# EAGLE design SmartRock_MS5803_Breakout (EAGLE 9.6.2)
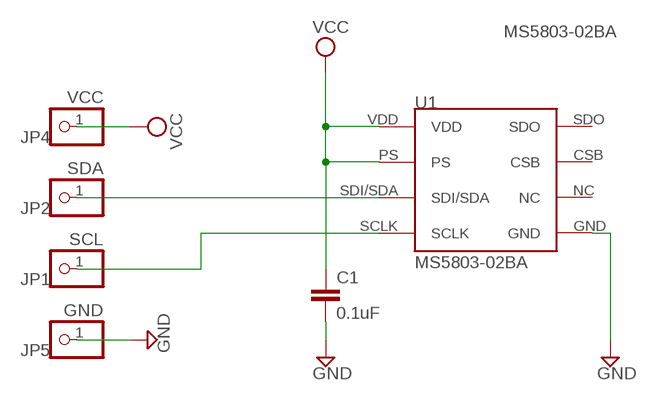
[diagram p0: schematic, sheet 1]

## Parts
C1  0.1uF  C-EUC0805  [C0805]
JP1  SCL  PINHD-1X1  [1X01]
JP2  SDA  PINHD-1X1  [1X01]
JP4  VCC  PINHD-1X1  [1X01]
JP5  GND  PINHD-1X1  [1X01]
U1  MS5803-02BA  [MS5803-02BA]

## Nets
GND: C1.2 JP5.1 U1.GND
N$1: JP2.1 U1.SDI/SDA
N$2: JP1.1 U1.SCLK
VCC: C1.1 JP4.1 U1.PS U1.VDD
Unconnected: U1.CSB U1.NC U1.SDO

## Notes on the sheet
- MS5803-02BA

## Library data of the parts
C1 = rcl:C-EU: CAPACITOR, European symbol; SPICEPREFIX: C
JP1 JP2 JP4 JP5 = pinhead_simple:PINHD-1X1: PIN HEADER
U1 = PNNL_Probe:MS5803-02BA

## Board
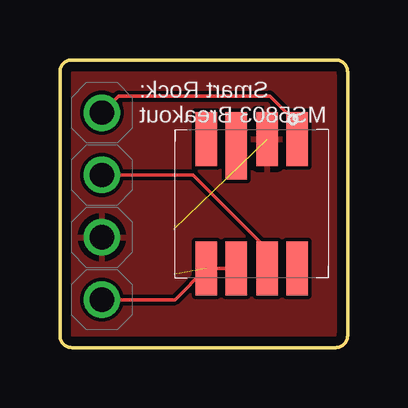
[diagram p1: board, top side]
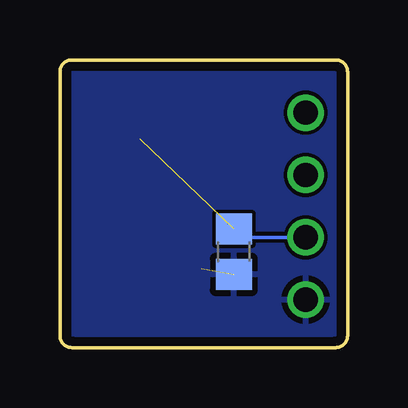
[diagram p2: board, bottom side, seen from below]

Size 12 x 12 mm. Coordinates in mm from the lower left corner, seen from the top.
Outline: 0.5,12 11.5,12 arc-90 12,11.5 12,0.5 arc-90 11.5,0 0.5,0 arc-90 0,0.5 0,11.5 arc-90 0.5,12
Copper layers (1*16): Top 0.035559375mm / dielectric 1.6mm / Bottom 0.035559375mm
Design rules "oshpark-2layer": minimum track width 6mil, minimum drill 10mil, track to track 6mil, track to pad 6mil, pad to pad 6mil, via to via 6mil, smd to smd 6mil, copper to edge 15mil, drill to drill 6mil, minimum pad ring 5mil, minimum via ring 5mil, stop-mask expansion 2.5mil, vias tented up to drill 0mil, thermal gap 10mil

### Footprints (pad centres in the part's own frame; a part is rotated, then mirrored left to right if it is on the bottom)
C0805 = smd 1.3 x 1.5: 1 -0.95,0; 2 0.95,0
1X01 = drill 1.016: 1 0,0
MS5803-02BA = smd 2.8 x 0.9: CSB 2.42,0.65 | smd 2.25 x 0.9: GND 2.7,-0.65; NC 2.7,1.9; PS -2.7,0.65; SCLK 2.7,-1.9; SDI/SDA -2.7,-0.65; SDO -2.7,-1.9; VDD -2.7,1.9

### Placement (x,y rotation side)
C1  4.75,4 90 bottom
JP1  1.75,9.8 0 top
JP2  1.75,7.2 0 top
JP4  1.75,2 0 top
JP5  1.75,4.6 0 top
U1  8,6 90 top

### Tracks (layer width: path | path; a pad name or v marks a point on that pad's centre or on a via)
GND  (1 unrouted)
  Bottom 0.152: JP5.1 4.4,4.6 C1.2
  pour Top: -0.25,12.25 -0.25,-0.25 12.25,-0.25 12.25,12.25
N$1
  Top 0.152: U1.SDI/SDA 8.65,4.1 5.55,7.2 JP2.1
N$2
  Top 0.152: JP1.1 2.45,10.5 8.75,10.5 9.9,9.35 U1.SCLK
VCC  (1 unrouted)
  Top 0.152: JP4.1 4.8,2 U1.VDD U1.PS
  pour Bottom: -0.5,12.5 -0.5,-0.5 12.5,-0.5 12.5,12.5

### Text on the board
tPlace: Smart Rock: / MS5803 Breakout